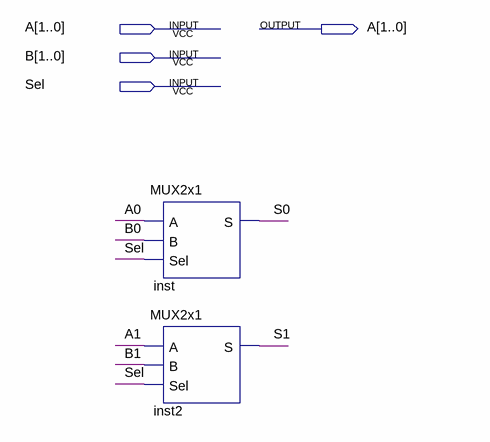
[diagram p0: schematic sheet]
// Quartus schematic MUX2x2.bdf as structural Verilog: 2 symbols, 4 pins
module MUX2x2 (
  inout  [1:0] A,
  input  [1:0] B,
  input  Sel
);

  wire S0, S1;

  MUX2x1 inst (.A(A[0]), .B(B[0]), .Sel(Sel), .S(S0));
  MUX2x1 inst2 (.A(A[1]), .B(B[1]), .Sel(Sel), .S(S1));
endmodule
